# Altium schematic sheet TMRSensors.SchDoc
size A1; SheetNumber: 1; SheetTotal: 1
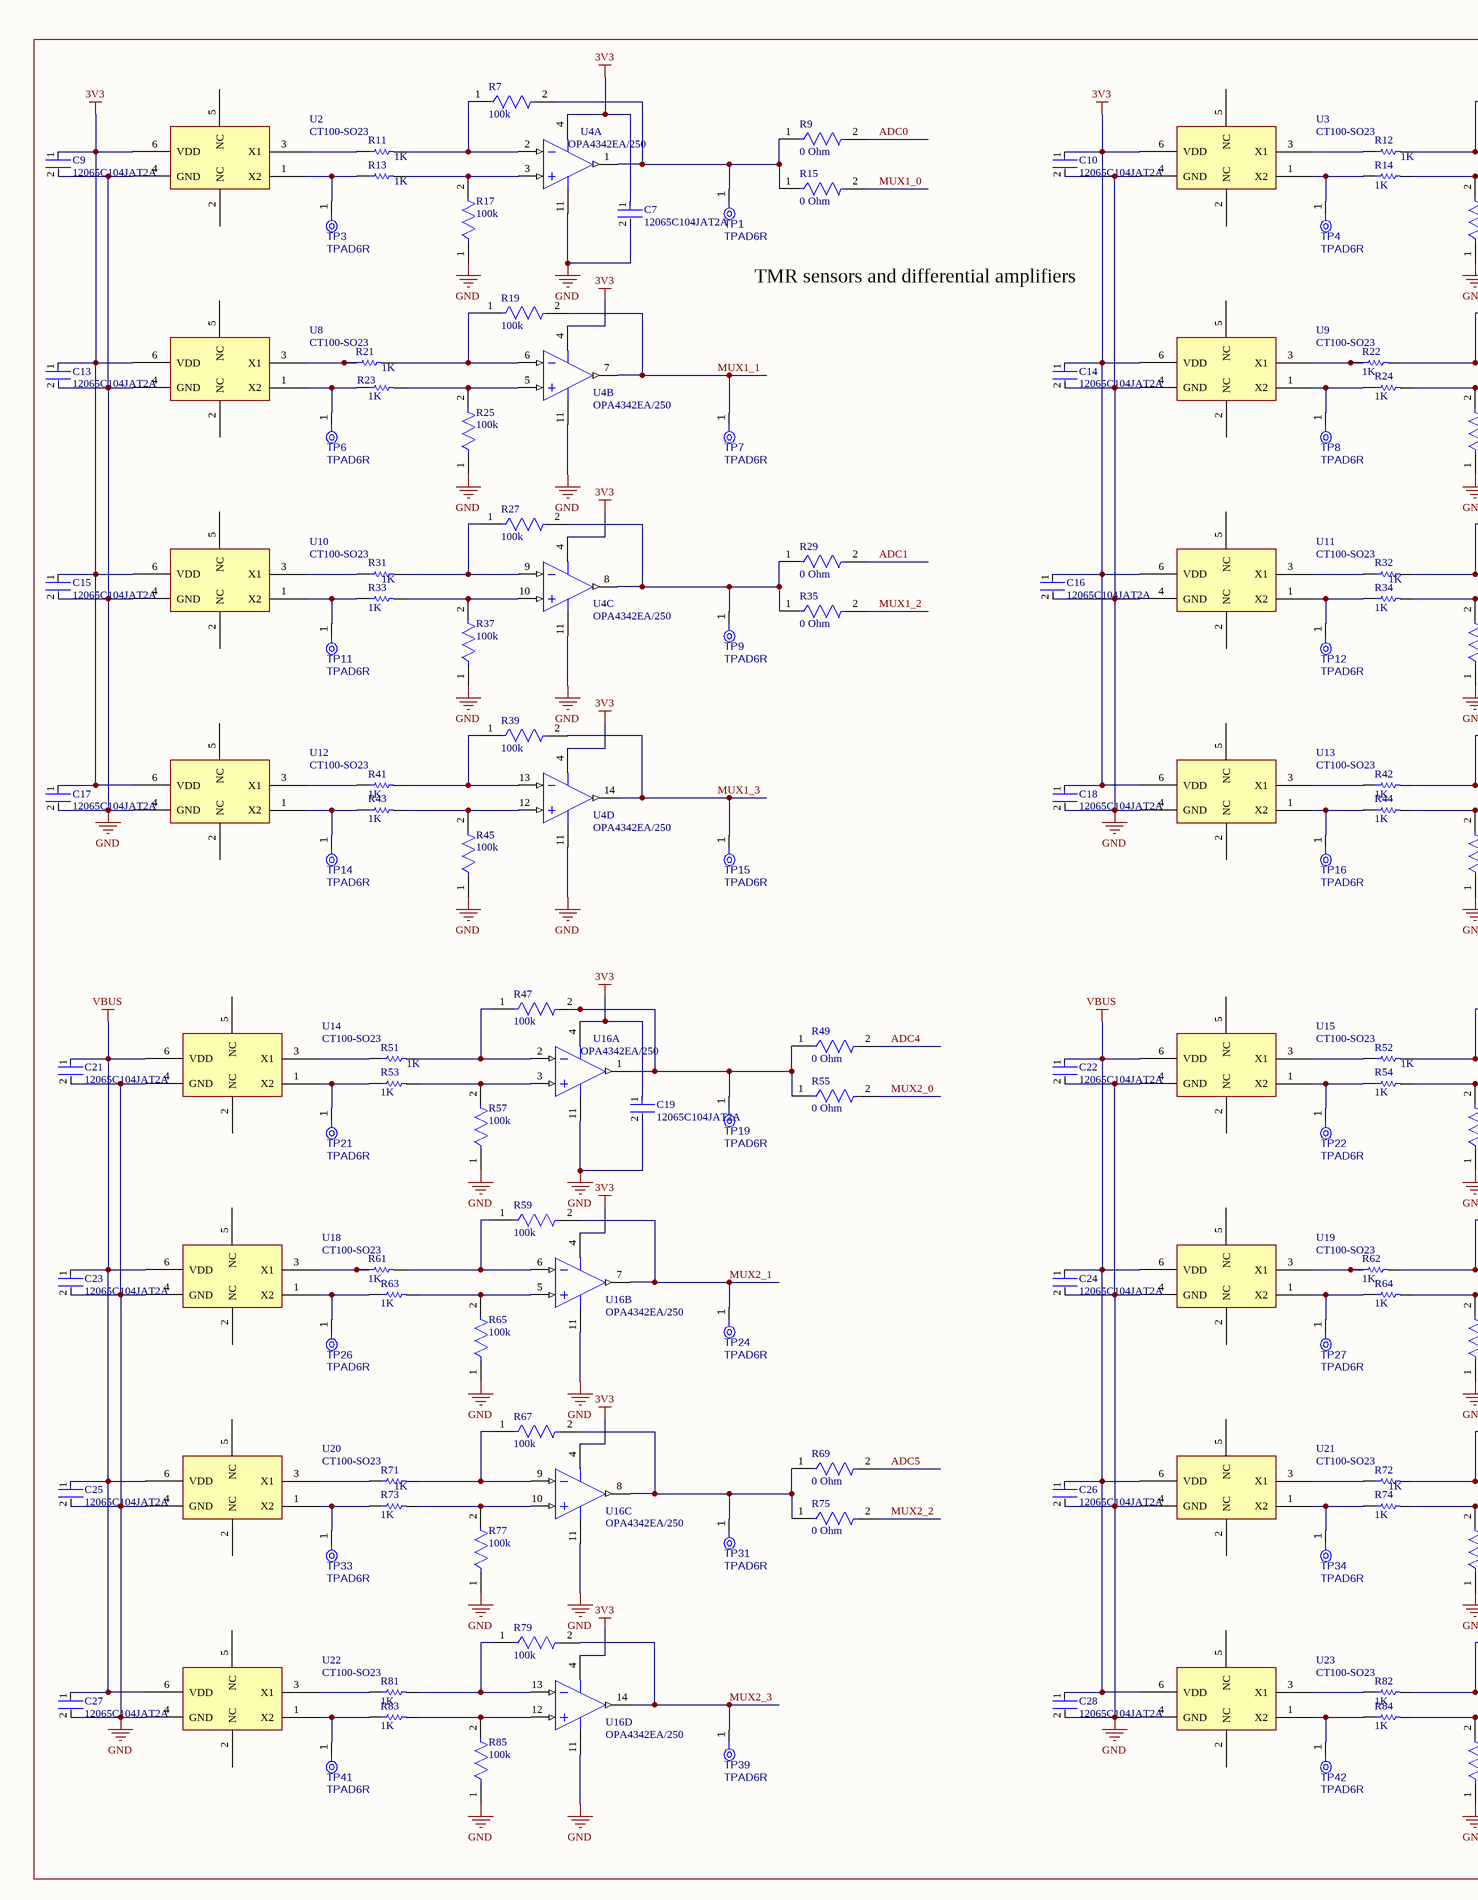
[diagram p0: TMRSensors.SchDoc, left]
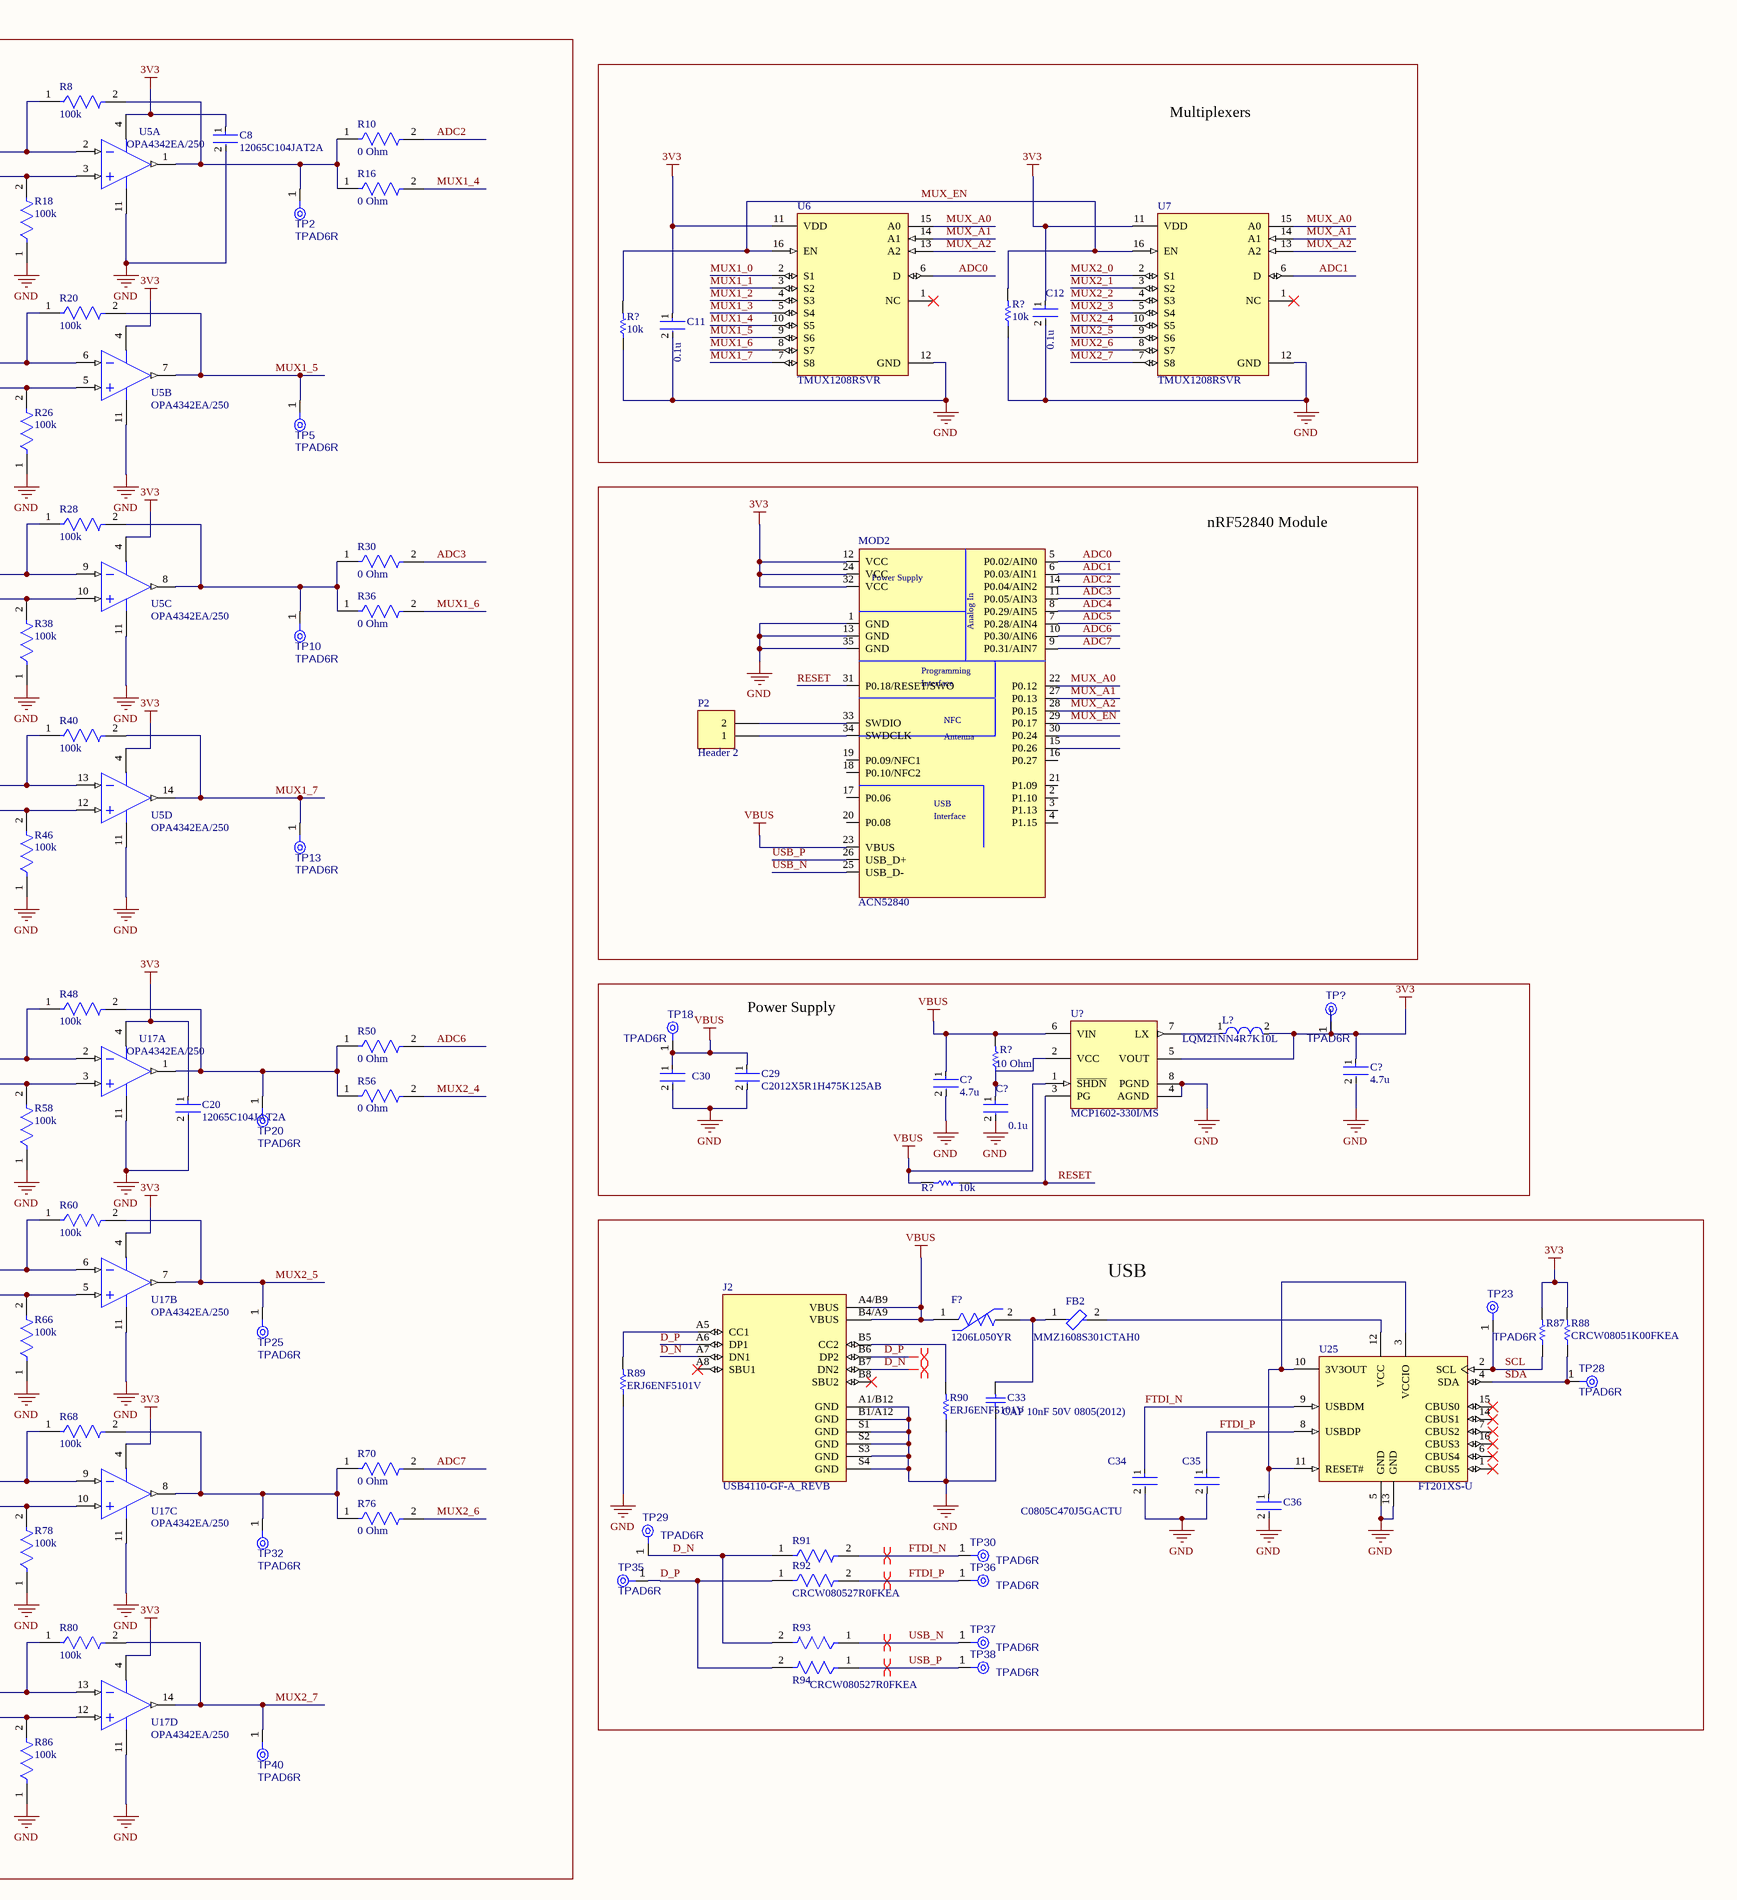
[diagram p1: TMRSensors.SchDoc, right]

## Parts
(Parts that share a designator on the sheet are numbered #1, #2 ... from top to bottom, then left to right.)
C7  12065C104JAT2A  [FP-1206-L_3_2_0_2-W_1_6_0-IPC_A]
C8  12065C104JAT2A  [FP-1206-L_3_2_0_2-W_1_6_0-IPC_A]
C9  12065C104JAT2A  [FP-1206-L_3_2_0_2-W_1_6_0-IPC_A]
C10  12065C104JAT2A  [FP-1206-L_3_2_0_2-W_1_6_0-IPC_A]
C11  0.1u  [FP-1206-L_3_2_0_2-W_1_6_0-IPC_A]
C12  0.1u  [FP-1206-L_3_2_0_2-W_1_6_0-IPC_A]
C13  12065C104JAT2A  [FP-1206-L_3_2_0_2-W_1_6_0-IPC_A]
C14  12065C104JAT2A  [FP-1206-L_3_2_0_2-W_1_6_0-IPC_A]
C15  12065C104JAT2A  [FP-1206-L_3_2_0_2-W_1_6_0-IPC_A]
C16  12065C104JAT2A  [FP-1206-L_3_2_0_2-W_1_6_0-IPC_A]
C17  12065C104JAT2A  [FP-1206-L_3_2_0_2-W_1_6_0-IPC_A]
C18  12065C104JAT2A  [FP-1206-L_3_2_0_2-W_1_6_0-IPC_A]
C19  12065C104JAT2A  [FP-1206-L_3_2_0_2-W_1_6_0-IPC_A]
C20  12065C104JAT2A  [FP-1206-L_3_2_0_2-W_1_6_0-IPC_A]
C21  12065C104JAT2A  [FP-1206-L_3_2_0_2-W_1_6_0-IPC_A]
C22  12065C104JAT2A  [FP-1206-L_3_2_0_2-W_1_6_0-IPC_A]
C23  12065C104JAT2A  [FP-1206-L_3_2_0_2-W_1_6_0-IPC_A]
C24  12065C104JAT2A  [FP-1206-L_3_2_0_2-W_1_6_0-IPC_A]
C25  12065C104JAT2A  [FP-1206-L_3_2_0_2-W_1_6_0-IPC_A]
C26  12065C104JAT2A  [FP-1206-L_3_2_0_2-W_1_6_0-IPC_A]
C27  12065C104JAT2A  [FP-1206-L_3_2_0_2-W_1_6_0-IPC_A]
C28  12065C104JAT2A  [FP-1206-L_3_2_0_2-W_1_6_0-IPC_A]
C29  C2012X5R1H475K125AB  [FP-C2012-125-0_2-IPC_B]
C30  C0805C104K5RACTU  [FP-C0805C-DN-MFG]  (value not drawn)
C33  CAP 10nF 50V 0805(2012)  [CAPC0805(2012)75_N]
C34  C0805C470J5GACTU  [FP-C0805C-DN-MFG]
C35  C0805C470J5GACTU  [FP-C0805C-DN-MFG]  (value not drawn)
C36  C0805C104K5RACTU  [FP-C0805C-DN-MFG]  (value not drawn)
C?#1  4.7u  [FP-C2012-125-0_2-IPC_B]
C?#2  4.7u  [FP-GRM32-MFG]
C?#3  0.1u  [FP-1206-L_3_2_0_2-W_1_6_0-IPC_A]
F?  1206L050YR  [FP-1206L050YR-MFG]
FB2  MMZ1608S301CTAH0  [FP-MMZ1608-0_6-IPC_C]
J2  USB4110-GF-A_REVB  [GCT_USB4110-GF-A_REVB]
L?  LQM21NN4R7K10L  [FP-LQM21DH_70-IPC_C]
MOD2  ACN52840  [ACN52840]
P2  Header 2  [HDR1X2]
R7  100k  [FP-AC0805-MFG]
R8  100k  [FP-AC0805-MFG]
R9  0 Ohm  [FP-RC1206-MFG]
R10  0 Ohm  [FP-RC1206-MFG]
R11  1K  [RESC3216X70X50LL05T20]
R12  1K  [RESC3216X70X50LL05T20]
R13  1K  [RESC3216X70X50LL05T20]
R14  1K  [RESC3216X70X50LL05T20]
R15  0 Ohm  [FP-RC1206-MFG]
R16  0 Ohm  [FP-RC1206-MFG]
R17  100k  [FP-AC0805-MFG]
R18  100k  [FP-AC0805-MFG]
R19  100k  [FP-AC0805-MFG]
R20  100k  [FP-AC0805-MFG]
R21  1K  [RESC3216X70X50LL05T20]
R22  1K  [RESC3216X70X50LL05T20]
R23  1K  [RESC3216X70X50LL05T20]
R24  1K  [RESC3216X70X50LL05T20]
R25  100k  [FP-AC0805-MFG]
R26  100k  [FP-AC0805-MFG]
R27  100k  [FP-AC0805-MFG]
R28  100k  [FP-AC0805-MFG]
R29  0 Ohm  [FP-RC1206-MFG]
R30  0 Ohm  [FP-RC1206-MFG]
R31  1K  [RESC3216X70X50LL05T20]
R32  1K  [RESC3216X70X50LL05T20]
R33  1K  [RESC3216X70X50LL05T20]
R34  1K  [RESC3216X70X50LL05T20]
R35  0 Ohm  [FP-RC1206-MFG]
R36  0 Ohm  [FP-RC1206-MFG]
R37  100k  [FP-AC0805-MFG]
R38  100k  [FP-AC0805-MFG]
R39  100k  [FP-AC0805-MFG]
R40  100k  [FP-AC0805-MFG]
R41  1K  [RESC3216X70X50LL05T20]
R42  1K  [RESC3216X70X50LL05T20]
R43  1K  [RESC3216X70X50LL05T20]
R44  1K  [RESC3216X70X50LL05T20]
R45  100k  [FP-AC0805-MFG]
R46  100k  [FP-AC0805-MFG]
R47  100k  [FP-AC0805-MFG]
R48  100k  [FP-AC0805-MFG]
R49  0 Ohm  [FP-RC1206-MFG]
R50  0 Ohm  [FP-RC1206-MFG]
R51  1K  [RESC3216X70X50LL05T20]
R52  1K  [RESC3216X70X50LL05T20]
R53  1K  [RESC3216X70X50LL05T20]
R54  1K  [RESC3216X70X50LL05T20]
R55  0 Ohm  [FP-RC1206-MFG]
R56  0 Ohm  [FP-RC1206-MFG]
R57  100k  [FP-AC0805-MFG]
R58  100k  [FP-AC0805-MFG]
R59  100k  [FP-AC0805-MFG]
R60  100k  [FP-AC0805-MFG]
R61  1K  [RESC3216X70X50LL05T20]
R62  1K  [RESC3216X70X50LL05T20]
R63  1K  [RESC3216X70X50LL05T20]
R64  1K  [RESC3216X70X50LL05T20]
R65  100k  [FP-AC0805-MFG]
R66  100k  [FP-AC0805-MFG]
R67  100k  [FP-AC0805-MFG]
R68  100k  [FP-AC0805-MFG]
R69  0 Ohm  [FP-RC1206-MFG]
R70  0 Ohm  [FP-RC1206-MFG]
R71  1K  [RESC3216X70X50LL05T20]
R72  1K  [RESC3216X70X50LL05T20]
R73  1K  [RESC3216X70X50LL05T20]
R74  1K  [RESC3216X70X50LL05T20]
R75  0 Ohm  [FP-RC1206-MFG]
R76  0 Ohm  [FP-RC1206-MFG]
R77  100k  [FP-AC0805-MFG]
R78  100k  [FP-AC0805-MFG]
R79  100k  [FP-AC0805-MFG]
R80  100k  [FP-AC0805-MFG]
R81  1K  [RESC3216X70X50LL05T20]
R82  1K  [RESC3216X70X50LL05T20]
R83  1K  [RESC3216X70X50LL05T20]
R84  1K  [RESC3216X70X50LL05T20]
R85  100k  [FP-AC0805-MFG]
R86  100k  [FP-AC0805-MFG]
R87  CRCW08051K00FKEA  [RESC2013X50X30NL20T20]  (value not drawn)
R88  CRCW08051K00FKEA  [RESC2013X50X30NL20T20]
R89  ERJ6ENF5101V  [RESC2013X70X40LL20T20]
R90  ERJ6ENF5101V  [RESC2013X70X40LL20T20]
R91  CRCW080527R0FKEA  [FP-CRCW0805-e3-IPC_B]  (value not drawn)
R92  CRCW080527R0FKEA  [FP-CRCW0805-e3-IPC_B]
R93  CRCW080527R0FKEA  [FP-CRCW0805-e3-IPC_B]
R94  CRCW080527R0FKEA  [FP-CRCW0805-e3-IPC_B]  (value not drawn)
R?#1  10k  [RESC2013X60X35NL10T20]
R?#2  10k  [RESC2013X60X35NL10T20]
R?#3  10 Ohm  [RESC2013X60X35ML10T20]
R?#4  10k  [RESC2013X60X35NL10T20]
TP1  TPAD6R  [TP06R]  (no BOM)
TP2  TPAD6R  [TP06R]  (no BOM)
TP3  TPAD6R  [TP06R]  (no BOM)
TP4  TPAD6R  [TP06R]  (no BOM)
TP5  TPAD6R  [TP06R]  (no BOM)
TP6  TPAD6R  [TP06R]  (no BOM)
TP7  TPAD6R  [TP06R]  (no BOM)
TP8  TPAD6R  [TP06R]  (no BOM)
TP9  TPAD6R  [TP06R]  (no BOM)
TP10  TPAD6R  [TP06R]  (no BOM)
TP11  TPAD6R  [TP06R]  (no BOM)
TP12  TPAD6R  [TP06R]  (no BOM)
TP13  TPAD6R  [TP06R]  (no BOM)
TP14  TPAD6R  [TP06R]  (no BOM)
TP15  TPAD6R  [TP06R]  (no BOM)
TP16  TPAD6R  [TP06R]  (no BOM)
TP18  TPAD6R  [TP06R]  (no BOM)
TP19  TPAD6R  [TP06R]  (no BOM)
TP20  TPAD6R  [TP06R]  (no BOM)
TP21  TPAD6R  [TP06R]  (no BOM)
TP22  TPAD6R  [TP06R]  (no BOM)
TP23  TPAD6R  [TP06R]  (no BOM)
TP24  TPAD6R  [TP06R]  (no BOM)
TP25  TPAD6R  [TP06R]  (no BOM)
TP26  TPAD6R  [TP06R]  (no BOM)
TP27  TPAD6R  [TP06R]  (no BOM)
TP28  TPAD6R  [TP06R]  (no BOM)
TP29  TPAD6R  [TP06R]  (no BOM)
TP30  TPAD6R  [TP06R]  (no BOM)
TP31  TPAD6R  [TP06R]  (no BOM)
TP32  TPAD6R  [TP06R]  (no BOM)
TP33  TPAD6R  [TP06R]  (no BOM)
TP34  TPAD6R  [TP06R]  (no BOM)
TP35  TPAD6R  [TP06R]  (no BOM)
TP36  TPAD6R  [TP06R]  (no BOM)
TP37  TPAD6R  [TP06R]  (no BOM)
TP38  TPAD6R  [TP06R]  (no BOM)
TP39  TPAD6R  [TP06R]  (no BOM)
TP40  TPAD6R  [TP06R]  (no BOM)
TP41  TPAD6R  [TP06R]  (no BOM)
TP42  TPAD6R  [TP06R]  (no BOM)
TP?  TPAD6R  [TP06R]  (no BOM)
U2  CT100-SO23  [SOT95P280X135-6N]
U3  CT100-SO23  [SOT95P280X135-6N]
U4  OPA4342EA/250  [PW0014A_M]  (parts A,B,C,D of 4)
U5  OPA4342EA/250  [PW0014A_M]  (parts A,B,C,D of 4)
U6  TMUX1208RSVR  [FP-RSV0016A-MFG]
U7  TMUX1208RSVR  [FP-RSV0016A-MFG]
U8  CT100-SO23  [SOT95P280X135-6N]
U9  CT100-SO23  [SOT95P280X135-6N]
U10  CT100-SO23  [SOT95P280X135-6N]
U11  CT100-SO23  [SOT95P280X135-6N]
U12  CT100-SO23  [SOT95P280X135-6N]
U13  CT100-SO23  [SOT95P280X135-6N]
U14  CT100-SO23  [SOT95P280X135-6N]
U15  CT100-SO23  [SOT95P280X135-6N]
U16  OPA4342EA/250  [PW0014A_M]  (parts A,B,C,D of 4)
U17  OPA4342EA/250  [PW0014A_M]  (parts A,B,C,D of 4)
U18  CT100-SO23  [SOT95P280X135-6N]
U19  CT100-SO23  [SOT95P280X135-6N]
U20  CT100-SO23  [SOT95P280X135-6N]
U21  CT100-SO23  [SOT95P280X135-6N]
U22  CT100-SO23  [SOT95P280X135-6N]
U23  CT100-SO23  [SOT95P280X135-6N]
U25  FT201XS-U  [SSOP-16_N]
U?  MCP1602-330I/MS  [MSOP-MS8_M]

## Nets
3V3: C7.1 C8.1 C9.1 C10.1 C11.1 C12.1 C13.1 C14.1 C15.1 C16.1 C17.1 C18.1 C19.1 C20.1 C?#1.1 L?.2 MOD2.12(VCC) MOD2.24(VCC) MOD2.32(VCC) R87.2 R88.2 TP?.1(TP) U2.6(VDD) U3.6(VDD) U4.4(V+) U5.4(V+) U6.11(VDD) U7.11(VDD) U8.6(VDD) U9.6(VDD) U10.6(VDD) U11.6(VDD) U12.6(VDD) U13.6(VDD) U16.4(V+) U17.4(V+) U?.5(VOUT)
GND: C7.2 C8.2 C9.2 C10.2 C11.2 C12.2 C13.2 C14.2 C15.2 C16.2 C17.2 C18.2 C19.2 C20.2 C21.2 C22.2 C23.2 C24.2 C25.2 C26.2 C27.2 C28.2 C29.2 C30.2 C33.1 C34.2 C35.2 C36.2 C?#1.2 C?#2.2 C?#3.2 J2.A1/B12(GND) J2.B1/A12(GND) J2.S1(GND) J2.S2(GND) J2.S3(GND) J2.S4(GND) MOD2.1(GND) MOD2.13(GND) MOD2.35(GND) R17.1 R18.1 R25.1 R26.1 R37.1 R38.1 R45.1 R46.1 R57.1 R58.1 R65.1 R66.1 R77.1 R78.1 R85.1 R86.1 R89.1 R90.1 R?#1.1 R?#2.1 U2.4(GND) U3.4(GND) U4.11(V-) U5.11(V-) U6.12(GND) U7.12(GND) U8.4(GND) U9.4(GND) U10.4(GND) U11.4(GND) U12.4(GND) U13.4(GND) U14.4(GND) U15.4(GND) U16.11(V-) U17.11(V-) U18.4(GND) U19.4(GND) U20.4(GND) U21.4(GND) U22.4(GND) U23.4(GND) U25.5(GND) U25.13(GND) U?.4(AGND) U?.8(PGND)
VBUS: C21.1 C22.1 C23.1 C24.1 C25.1 C26.1 C27.1 C28.1 C29.1 C30.1 C?#2.1 F?.1 J2.A4/B9(VBUS) J2.B4/A9(VBUS) MOD2.23(VBUS) R?#3.2 R?#4.2 TP18.1(TP) U14.6(VDD) U15.6(VDD) U18.6(VDD) U19.6(VDD) U20.6(VDD) U21.6(VDD) U22.6(VDD) U23.6(VDD) U?.1(~{SHDN}) U?.6(VIN)
ADC0: MOD2.5(P0.02/AIN0) R9.2 U6.6(D)
ADC1: MOD2.6(P0.03/AIN1) R29.2 U7.6(D)
ADC2: MOD2.14(P0.04/AIN2) R10.2
ADC3: MOD2.11(P0.05/AIN3) R30.2
ADC4: MOD2.8(P0.29/AIN5) R49.2
ADC5: MOD2.7(P0.28/AIN4) R69.2
ADC6: MOD2.10(P0.30/AIN6) R50.2
ADC7: MOD2.9(P0.31/AIN7) R70.2
D_N: J2.A7(DN1) J2.B7(DN2) R91.1 R93.2 TP29.1(TP)
D_P: J2.A6(DP1) J2.B6(DP2) R92.1 R94.2 TP35.1(TP)
FTDI_N: C34.1 R91.2 TP30.1(TP) U25.9(USBDM)
FTDI_P: C35.1 R92.2 TP36.1(TP) U25.8(USBDP)
MUX1_0: R15.2 U6.2(S1)
MUX1_1: R19.2 TP7.1(TP) U4.7(OUT_B) U6.3(S2)
MUX1_2: R35.2 U6.4(S3)
MUX1_3: R39.2 TP15.1(TP) U4.14(OUT_D) U6.5(S4)
MUX1_4: R16.2 U6.10(S5)
MUX1_5: R20.2 TP5.1(TP) U5.7(OUT_B) U6.9(S6)
MUX1_6: R36.2 U6.8(S7)
MUX1_7: R40.2 TP13.1(TP) U5.14(OUT_D) U6.7(S8)
MUX2_0: R55.2 U7.2(S1)
MUX2_1: R59.2 TP24.1(TP) U7.3(S2) U16.7(OUT_B)
MUX2_2: R75.2 U7.4(S3)
MUX2_3: R79.2 TP39.1(TP) U7.5(S4) U16.14(OUT_D)
MUX2_4: R56.2 U7.10(S5)
MUX2_5: R60.2 TP25.1(TP) U7.9(S6) U17.7(OUT_B)
MUX2_6: R76.2 U7.8(S7)
MUX2_7: R80.2 TP40.1(TP) U7.7(S8) U17.14(OUT_D)
MUX_A0: MOD2.22(P0.12) U6.15(A0) U7.15(A0)
MUX_A1: MOD2.27(P0.13) U6.14(A1) U7.14(A1)
MUX_A2: MOD2.28(P0.15) U6.13(A2) U7.13(A2)
MUX_EN: MOD2.29(P0.17) R?#1.2 R?#2.2 U6.16(EN) U7.16(EN)
RESET: MOD2.31(P0.18/RESET/SWO) R?#4.1 U?.3(PG)
SCL: R87.1 TP23.1(TP) U25.2(SCL)
SDA: R88.1 TP28.1(TP) U25.4(SDA)
USB_N: MOD2.25(USB_D-) R93.1 TP37.1(TP)
USB_P: MOD2.26(USB_D+) R94.1 TP38.1(TP)
NetC33_2: C33.2 F?.2 FB2.1
NetC36_1: C36.1 U25.3(VCCIO) U25.10(3V3OUT) U25.11(RESET#)
NetC?#3_1: C?#3.1 R?#3.1 U?.2(VCC)
NetFB2_2: FB2.2 U25.12(VCC)
NetJ2_A5: J2.A5(CC1) R89.2
NetJ2_B5: J2.B5(CC2) R90.2
NetL?_1: L?.1 U?.7(LX)
NetMOD2_33: MOD2.33(SWDIO) P2.2
NetMOD2_34: MOD2.34(SWDCLK) P2.1
NetR7_1: R7.1 R11.2 U4.2(IN_A-)
NetR7_2: R7.2 R9.1 R15.1 TP1.1(TP) U4.1(OUT_A)
NetR8_1: R8.1 R12.2 U5.2(IN_A-)
NetR8_2: R8.2 R10.1 R16.1 TP2.1(TP) U5.1(OUT_A)
NetR11_1: R11.1 U2.3(X1)
NetR12_1: R12.1 U3.3(X1)
NetR13_1: R13.1 TP3.1(TP) U2.1(X2)
NetR13_2: R13.2 R17.2 U4.3(IN_A+)
NetR14_1: R14.1 TP4.1(TP) U3.1(X2)
NetR14_2: R14.2 R18.2 U5.3(IN_A+)
NetR19_1: R19.1 R21.2 U4.6(IN_B-)
NetR20_1: R20.1 R22.2 U5.6(IN_B-)
NetR21_1: R21.1 U8.3(X1)
NetR22_1: R22.1 U9.3(X1)
NetR23_1: R23.1 TP6.1(TP) U8.1(X2)
NetR23_2: R23.2 R25.2 U4.5(IN_B+)
NetR24_1: R24.1 TP8.1(TP) U9.1(X2)
NetR24_2: R24.2 R26.2 U5.5(IN_B+)
NetR27_1: R27.1 R31.2 U4.9(IN_C-)
NetR27_2: R27.2 R29.1 R35.1 TP9.1(TP) U4.8(OUT_C)
NetR28_1: R28.1 R32.2 U5.9(IN_C-)
NetR28_2: R28.2 R30.1 R36.1 TP10.1(TP) U5.8(OUT_C)
NetR31_1: R31.1 U10.3(X1)
NetR32_1: R32.1 U11.3(X1)
NetR33_1: R33.1 TP11.1(TP) U10.1(X2)
NetR33_2: R33.2 R37.2 U4.10(IN_C+)
NetR34_1: R34.1 TP12.1(TP) U11.1(X2)
NetR34_2: R34.2 R38.2 U5.10(IN_C+)
NetR39_1: R39.1 R41.2 U4.13(IN_D-)
NetR40_1: R40.1 R42.2 U5.13(IN_D-)
NetR41_1: R41.1 U12.3(X1)
NetR42_1: R42.1 U13.3(X1)
NetR43_1: R43.1 TP14.1(TP) U12.1(X2)
NetR43_2: R43.2 R45.2 U4.12(IN_D+)
NetR44_1: R44.1 TP16.1(TP) U13.1(X2)
NetR44_2: R44.2 R46.2 U5.12(IN_D+)
NetR47_1: R47.1 R51.2 U16.2(IN_A-)
NetR47_2: R47.2 R49.1 R55.1 TP19.1(TP) U16.1(OUT_A)
NetR48_1: R48.1 R52.2 U17.2(IN_A-)
NetR48_2: R48.2 R50.1 R56.1 TP20.1(TP) U17.1(OUT_A)
NetR51_1: R51.1 U14.3(X1)
NetR52_1: R52.1 U15.3(X1)
NetR53_1: R53.1 TP21.1(TP) U14.1(X2)
NetR53_2: R53.2 R57.2 U16.3(IN_A+)
NetR54_1: R54.1 TP22.1(TP) U15.1(X2)
NetR54_2: R54.2 R58.2 U17.3(IN_A+)
NetR59_1: R59.1 R61.2 U16.6(IN_B-)
NetR60_1: R60.1 R62.2 U17.6(IN_B-)
NetR61_1: R61.1 U18.3(X1)
NetR62_1: R62.1 U19.3(X1)
NetR63_1: R63.1 TP26.1(TP) U18.1(X2)
NetR63_2: R63.2 R65.2 U16.5(IN_B+)
NetR64_1: R64.1 TP27.1(TP) U19.1(X2)
NetR64_2: R64.2 R66.2 U17.5(IN_B+)
NetR67_1: R67.1 R71.2 U16.9(IN_C-)
NetR67_2: R67.2 R69.1 R75.1 TP31.1(TP) U16.8(OUT_C)
NetR68_1: R68.1 R72.2 U17.9(IN_C-)
NetR68_2: R68.2 R70.1 R76.1 TP32.1(TP) U17.8(OUT_C)
NetR71_1: R71.1 U20.3(X1)
NetR72_1: R72.1 U21.3(X1)
NetR73_1: R73.1 TP33.1(TP) U20.1(X2)
NetR73_2: R73.2 R77.2 U16.10(IN_C+)
NetR74_1: R74.1 TP34.1(TP) U21.1(X2)
NetR74_2: R74.2 R78.2 U17.10(IN_C+)
NetR79_1: R79.1 R81.2 U16.13(IN_D-)
NetR80_1: R80.1 R82.2 U17.13(IN_D-)
NetR81_1: R81.1 U22.3(X1)
NetR82_1: R82.1 U23.3(X1)
NetR83_1: R83.1 TP41.1(TP) U22.1(X2)
NetR83_2: R83.2 R85.2 U16.12(IN_D+)
NetR84_1: R84.1 TP42.1(TP) U23.1(X2)
NetR84_2: R84.2 R86.2 U17.12(IN_D+)

Not connected (* = marked no-connect by the designer): J2 A8(SBU1)* B8(SBU2)*; MOD2 2(P1.10) 3(P1.13) 4(P1.15) 15(P0.26) 16(P0.27) 17(P0.06) 18(P0.10/NFC2) 19(P0.09/NFC1) 20(P0.08) 21(P1.09) 30(P0.24); U2 2(NC) 5(NC); U3 2(NC) 5(NC); U6 1(NC)*; U7 1(NC)*; U8 2(NC) 5(NC); U9 2(NC) 5(NC); U10 2(NC) 5(NC); U11 2(NC) 5(NC); U12 2(NC) 5(NC); U13 2(NC) 5(NC); U14 2(NC) 5(NC); U15 2(NC) 5(NC); U18 2(NC) 5(NC); U19 2(NC) 5(NC); U20 2(NC) 5(NC); U21 2(NC) 5(NC); U22 2(NC) 5(NC); U23 2(NC) 5(NC); U25 1(CBUS5)* 6(CBUS4)* 7(CBUS2)* 14(CBUS1)* 15(CBUS0)* 16(CBUS3)*

## Layout directives
differential pair: D_N, D_P, FTDI_N, FTDI_P, USB_N, USB_P

## Notes on the sheet
- Multiplexers
- TMR sensors and differential amplifiers
- nRF52840 Module
- Power Supply
- (near FB2) USB
- (in symbol ACN52840) Power Supply; Analog In; Programming; Interface; NFC; Antenna; USB

## Library data of the parts
C7-C28 C?#3 = CMP-04427-019132-1: General Purpose Ceramic Capacitor, 1206, 100nF, 5%, X7R, 15%, 50V; Insulation Resistance: 100GR; Dissipation Factor: 2.5%; Depth: 1.6mm; Case/Package: 1206; REACH SVHC: No SVHC; Capacitance: 100nF; Height: 0.5mm; Termination: SMD/SMT; Packaging: Cut Tape; Voltage: 50V; Min Operating Temperature: -55°C; Width: 1.6mm; Dielectric: X7R; Series: X7R; Case Code (Metric): 3216; Contact Plating: Tin; Package Quantity: 4000; Lead Free: Lead Free; Thickness: 0.037inch; Voltage Rating (DC): 50V; RoHS Compliant: Yes; Voltage Rating: 50V; Length: 3.2mm; Tolerance: 5%; Mount: Surface Mount; Radiation Hardening: No; Weight: 0.000571oz; Max Operating Temperature: 125°C; Dielectric Material: Ceramic; Case Code (Imperial): 1206
C29 C?#1 = CMP-08246-000007-2: Multilayer Ceramic Capacitors 4.7μF ±10% 50V X5R SMD 0805; Capacitance: 4.7uF; Case Code (Metric): 2012; Weight: 0.000194oz; Voltage Rating: 50V; Voltage: 50V; Construction: Flat; Series: C; Packaging: Tape and Reel; Height: 1.25mm; Depth: 1.25mm; Resistor Type: Ceramic; Width: 0.049inch; Length: 2mm; Thickness: 0.057inch; REACH SVHC: No SVHC; Max Operating Temperature: 85°C; Case/Package: 0805; Dielectric: X5R; Tolerance: 10%; Dielectric Material: Ceramic; Package Quantity: 1; Mount: Surface Mount; Radiation Hardening: No; Voltage Rating (DC): 50V; Case Code (Imperial): 0805; Termination: SMD/SMT; Min Operating Temperature: -55°C; Lead Free: Lead Free
C30 C36 = CMP-2007-00279-2: CAP CER 0.1UF 50V X7R 0805; Manufacturer: KEMET; Value: 0.10 μF; Tolerance: 0.1; Temperature Coefficient: 30ppm/°C; Material: Ceramic; Manufacturer Part Number: C0805C104K5RACTU; Device Class L2: Capacitors; Temperature Range Low: -55°C; Voltage Rating: 50 V; Digikey Description: CAP CER 0.1UF 50V X7R 0805; Category: Cap; ComponentLink2Description: Datasheet; Octopart: https://octopart.com/c0805c104k5ractu-kemet-143926; RoHS: TRUE; ComponentLink2URL: https://content.kemet.com/datasheets/KEM_C1003_C0G_SMD.pdf; Temperature Characteristic: X7R; Temperature: -55°C to +125°C; Height: 0.88mm; Temperature Range High: +125°C; Device Class L1: Passive Components; Automotive: No; Lead Free: Yes; Ipc Land Pattern Name: CAPC200125X78; Device Class L3: Ceramic Capacitors; Mouser Description: Cap Ceramic 0.1uF 50V X7R 10% SMD 2.0 x 1.2 mm 125 C Paper T/R; Capacitance: 0.10 μF; Package: C0805C-DN
C33 = CMP-1036-03839-1: CAP 10nF 50V ±5% 0805 (2012 Metric) Thickness 0.75mm SMD; Case-Metric: 2012; Case-EIA: 0805; Tolerance: Â±5%; Technology: SMT; Max Thickness: 0.75 mm; Rated Voltage: 50 V; Value: 10nF
C34 C35 = CMP-2007-00435-2: CAP CER 47PF 50V C0G/NP0 0805; Manufacturer: KEMET; Temperature Characteristic: C0G; Material: Ceramic; Temperature Coefficient: 30ppm/°C; Tolerance: 0.05; Temperature Range High: +125°C; Device Class L1: Passive Components; Device Class L3: Ceramic Capacitors; Lead Free: Yes; Manufacturer Part Number: C0805C470J5GACTU; Temperature: -55°C to +125°C; Capacitance: 47 pF; Height: 0.88mm; Octopart: https://octopart.com/c0805c470j5gactu-kemet-150274; RoHS: TRUE; Category: Cap; Voltage Rating: 50 V; Automotive: No; Device Class L2: Capacitors; Value: 47 pF; Ipc Land Pattern Name: CAPC200125X78; Temperature Range Low: -55°C; Mouser Description: Multilayer Ceramic Capacitors MLCC - SMD/SMT 50volts 47pF C0G 5%; Package: C0805C-DN; Digikey Description: CAP CER 47PF 50V C0G/NP0 0805; ComponentLink2URL: https://content.kemet.com/datasheets/KEM_C1003_C0G_SMD.pdf; ComponentLink2Description: Datasheet
C?#2 = CMP-1038-02162-3: CAP CER 4.7UF 50V X7R 1210; Manufacturer: Murata; Manufacturer Part Number: GRM32ER71H475KA88L; Tolerance: 10%; Temperature Coefficient: 15%; Material: Ceramic; Lead Free: Yes; Value: 4.7uF; ComponentLink2Description: Datasheet; Capacitance: 4.7uF; Digikey Description: CAP CER 4.7UF 50V X7R 1210; Category: Cap; Automotive: No; ComponentLink2URL: https://search.murata.co.jp/Ceramy/image/img/A01X/G101/ENG/GRM32ER71H475KA88-01A.pdf; Package: GRM32; Device Class L2: Capacitors; Voltage Rating: 50V; Device Class L1: Passive Components; Mouser Description: Capacitor Capacitance tolerance: ±10% Ceramic type: X7R Construction form: 1210 Capacitance: 4.7 µF Rated voltage: 50...; Octopart: https://octopart.com/grm32er71h475ka88l-murata-196576; Temperature: -55°C to +125°C; Temperature Range Low: -55°C; Height: 2.7mm; Temperature Characteristic: X7R; Temperature Range High: +125°C; RoHS: TRUE; Device Class L3: Ceramic Capacitors
F? = CMP-08606-000073-1: PTC RESET FUSE 6V 500MA 1206; Trip Current: 1A; Current Rating: 100A; Resistance: 700mR; Approvals: cULus; Max Power Dissipation: 600mW; Time to Trip: 0.1s; Hold Current: 500mA; Min Operating Temperature: -40°C; Voltage Rating (DC): 6V; Working Voltage: 6V; Package Quantity: 4000; Termination: SMD/SMT; Lead Free: Lead Free; REACH SVHC: No SVHC; Series: 1206L; Max Voltage Rating (DC): 6V; Height: 0.75mm; Terminal Material: Copper; Packaging: Tape and Reel; Case Code (Imperial): 1206; Length: 3.4mm; RoHS Compliant: Yes; Operating Supply Voltage: 6V; Case Code (Metric): 3216; Width: 1.8mm; Max Current Rating: 100A; Case/Package: 1206; Power Dissipation: 600mW; Max Operating Temperature: 85°C; Voltage Rating: 6V
FB2 = CMP-08257-000259-1: Signal Line Ferrite Bead 300 Ω 100MHz 500mA DCR 250mΩ SMD 0603; Tolerance: 25%; Impedance: 300R; Number of Lines: 1; DC Resistance (DCR): 250mR; Length: 0.063inch; Max DC Current: 500mA; Case Code (Imperial): 0603; Termination: SMD/SMT; Weight: 7.1E-05oz; RoHS Compliant: No; Mount: Surface Mount; Height: 0.037inch; Max Current Rating: 500mA; Max Operating Temperature: 125°C; Width: 0.031inch; Packaging: Tape and Reel; Test Frequency: 100MHz; Case Code (Metric): 1608; Case/Package: 0603; Min Operating Temperature: -55°C; Package Quantity: 4000
J2 = USB4110-GF-A_REVB: MF: {'manufacturer': u'GCT'}; MP: USB4110-GF-A_REVB; Package: None; Price: None; Availability: Unavailable; Value: *
L? = CMP-06042-016801-1: Multilayer Type Inductor for General Circuits, 0805 (2012), 22μH, 30%, 0.65Ω, 13mA; Shielding: Shielded; Inductance Tolerance: 10%; Core Material: Ferrite; DC Resistance (DCR): 1R; Test Frequency: 10MHz; Current Rating: 30mA; Inductance: 4.7uH; Self Resonant Frequency: 47MHz; Q Factor: 45; Packaging: Tape and Reel; Width: 1.25mm; Package Quantity: 1; REACH SVHC: No SVHC; Min Operating Temperature: -40°C; Tolerance: 10%; Lead Free: Lead Free; Depth: 1.45mm; Termination: SMD/SMT; Case Code (Imperial): 0805; Case Code (Metric): 2012; Rated Current-Max: 30mA; Military Standard: Not; Length: 2mm; Series: LQM21N; Case/Package: 0805; Max DC Current: 30mA; DC Current: 30mA; Mount: Surface Mount; Height: 0.85mm; Max Operating Temperature: 85°C; Radiation Hardening: No
MOD2 = ACN52840: aconno ACN52840 Bluetooth 5, 2.4 GHz Module nRF52840 based with on-board PCB antenna.  Note:  Due to the existence of a Tag-Connect interface on the backside of the module, a PCB cut-out has been implemented.; MF: {'manufacturer': u'aconno'}; Availability: Unavailable; MP: ACN52840; Price: None; Package: None; Value: *
P2 = Header 2: Header, 2-Pin; LatestRevisionDate: 17-Jul-2002; LatestRevisionNote: Re-released for DXP Platform.; Publisher: Altium Limited
R7 R8 R17-R20 R25-R28 R37-R40 R45-R48 R57-R60 R65-R68 R77-R80 R85 R86 = CMP-2001-04479-2: Res Thick Film 0805 100K Ohm 1% 1/8W ±100ppm/°C Molded SMD SMD Paper T/R; Manufacturer: Yageo; Manufacturer Part Number: AC0805FR-07100KL; Voltage Rating: 150V; Value: 100KΩ; Tolerance: 0.01; Automotive Grade: Grade 0; Composition: Thick Film; Octopart: https://octopart.com/ac0805fr-07100kl-yageo-24517275; Series: AC; Device Class L1: Passive Components; Height: 0.6mm; Package: AC0805; Digikey Description: Res Thick Film 0805 100K Ohm 1% 1/8W ±100ppm/°C Molded SMD SMD Paper T/R; Power Rating: 1/8W; Temperature: -55°C to +155°C; Temperature Range High: +155°C; RoHS: TRUE; Mouser Description: Thick Film Resistors 1/8W 100K ohm 1% AEC-Q200; Temperature Range Low: -55°C; Resistance: 100KΩ; Footprint Url: http://www.yageo.com/exep/pages/download/literatures/PYu-R_Mount_10.pdf; Ipc Land Pattern Name: RESC200125X50; ComponentLink2Description: Datasheet; Automotive: Yes; Category: Res; Device Class L3: Chip SMD Resistors; Lead Free: Yes; ComponentLink2URL: http://www.yageo.com/documents/recent/PYu-AC_51_RoHS_L_6.pdf; Device Class L2: Resistors
R9 R10 R15 R16 R29 R30 R35 R36 R49 R50 R55 R56 R69 R70 R75 R76 = CMP-2100-03681-2: RES SMD 0 OHM JUMPER 1/4W 1206; Manufacturer Part Number: RC1206JR-070RL; Manufacturer: YAGEO; Voltage Rating: 200V; Temperature Coefficient: 300ppm/°C; Power Rating: 0.25W; Value: 0Ω; Tolerance: 5%; Temperature Range Low: -55°C; Category: Res; Automotive: No; Ipc Land Pattern Name: RESC310160X55; Device Class L1: Passive Components; Temperature: -55°C to +155°C; ComponentLink2URL: https://www.yageo.com/upload/media/product/productsearch/datasheet/rchip/PYu-RC_Group_51_RoHS_L_10.pdf; Lead Free: Yes; Height: 0.65mm; Footprint Url: https://www.yageo.com/upload/website/yageo_PYu-R_Mount_10_19050818_343.pdf; Package: RC1206; Digikey Description: RES SMD 0 OHM JUMPER 1/4W 1206; Temperature Range High: +155°C; Device Class L3: Chip SMD Resistors; Device Class L2: Resistors; Octopart: https://octopart.com/rc1206jr-070rl-yageo-40025601; Resistance: 0Ω; Series: RC; ComponentLink2Description: Datasheet; Composition: Thick Film; RoHS: TRUE; Mouser Description: Resistor: thick film; SMD; 1206; 0O; 0.25W; ±5%; -55÷155°C
R11-R14 R21-R24 R31-R34 R41-R44 R51-R54 R61-R64 R71-R74 R81-R84 = CMP-2003-00017-1: Manufacturer: Panasonic; Part Number: ERJ-8ENF1001V
R87 R88 = CMP-1013-00510-2: Manufacturer: Vishay Dale; Part Number: CRCW08051K00FKEA
R89 R90 = CMP-2001-00553-1: Manufacturer: Panasonic; Part Number: ERJ6ENF5101V
R91-R94 = CMP-2001-03744-2: RES Thick Film, 27Ω, 1%, 0.125W, 100ppm/°C, 0805; Working Voltage: 150V; Resistance: 27R; Max Power Dissipation: 125mW; Composition: Thick Film; Termination: SMD/SMT; Temperature Coefficient: 100ppm/°C; Contact Plating: Tin; Width: 0.049inch; Features: Automotive AEC-Q200; Voltage Rating: 150V; Military Standard: Not; Case Code (Imperial): 0805; Case Code (Metric): 2012; Voltage Rating (DC): 150V; Radiation Hardening: No; Length: 2mm; Packaging: Tape and Reel; Weight: 0.000194oz; Tolerance: 1%; Number of Terminations: 2; Case/Package: 0805; Height: 0.45mm; Power Rating: 125mW; Max Operating Temperature: 155°C; Package Quantity: 10; Depth: 1.25mm; Number of Pins: 2; Min Operating Temperature: -55°C; Lead Free: Lead Free
R?#1 R?#2 R?#4 = CMP-1659-00013-4: Chip Resistor, 10 KOhm, +/- 1%, 0.125 W, -55 to 155 degC, 0805 (2012 Metric), RoHS, Tape and Reel; Manufacturer: Yageo; Voltage Rating: 150 V; Mount: Surface Mount; ComponentLink1Description: Manufacturer URL; ComponentLink2URL: http://www.yageo.com/documents/recent/PYu-RC_Group_51_RoHS_L_04.pdf; Pins: 2; Length: 2 mm; Min Operating Temperature: -55 degC; Height: 0.5 mm; Mounting Technology: Surface Mount; RoHSCompliant: true; REACH SVHC: No SVHC; ComponentLink1URL: http://www.yageo.com/; Max Operating Temperature: 155 degC; PackageReference: 0805; DatasheetVersion: Rev. 4, 02/2016; Package Quantity: 5000; Packaging: Tape and Reel; ComponentLink2Description: Datasheet; PackageDescription: 2-Pin Surface Mounted Device, Body 2 x 1.25 mm
R?#3 = CMP-2100-03670-1: Chip Resistor, 10 Ohm, +/- 1%, 0.125 W, -55 to 155 degC, 0805 (2012 Metric), RoHS, Tape and Reel; Manufacturer: Yageo; Resistance: 10Ohm; Power Rating: 125mW; Voltage Rating: 150V; Temperature Coefficient: 200ppm/degreesC; Number of Pins: 2; REACH SVHC: NoSVHC; Datasheet Version: Rev. 5, 10/2016; Max Operating Temperature: 155degC; Manufacturer URL: http://www.yageo.com/; Case Code (Imperial): 0805; Package Description: 2-Pin Surface Mounted Device, Body 2 x 1.25 mm; Case Code (Metric): 2012; Length: 2mm; RoHSCompliant: true; Max Power Dissipation: 125mW; Depth: 1.25mm; Packaging: TapeandReel; Height: 0.5mm; Package Reference: 0805; Package Quantity: 1; Tolerance: 1%; Termination: SMD/SMT; Min Operating Temperature: -55degC; Lead Free: LeadFree; Width: 1.25mm; Voltage Rating (DC): 150V; Datasheet URL: http://www.yageo.com/NewPortal/yageodocoutput?fileName=/pdf/R-Chip/PYu-RC_Group_51_RoHS_L_5.pdf; Composition: ThickFilm; Number of Terminations: 2; Case/Package: 0805
TP1-TP16 TP18-TP42 TP? = CMP-00028-00002-2: 0.6mm round; Pins: 1
U2 U3 U8-U15 U18-U23 = CMP-010-00025-1: TMR Sensor
U4 U5 U16 U17 = CMP-0272-01744-3: Low Cost, Low Power, Rail-to-Rail Operational Amplifier MicroAmplifier(TM) Series, 2.7 to 5.5 V, -55 to 125 degC, 14-pin SOP (PW14), Green (RoHS & no Sb/Br); Manufacturer: Texas Instruments; Rating: Catalog; IIB(Max)(pA): 10; Number of Channels: 4; Total Supply Voltage(Min)(+5V is 5, +/-5V is 10): 2.7; Slew Rate(Typ)(V/us): 1; Iq per channel(Max)(mA): 0.25; Sub Family: Low Input Bias Current Amp (<=10pA), Low Power Amp (<=500uA), Low Supply Voltage Amplifier (<=2.7V), Precision Amplifier; Offset Drift(Typ)(uV/C): 3; CMRR(Min)(dB): 76; Vio (25C)(Max)(mV): 6; Total Supply Voltage(Max)(+5V is 5, +/-5V is 10): 5.5; Packing: SMALL T&R; PackageReference: PW0014A; PackageVersion: 4040064-3/G, 02/2011; ComponentLink1Description: Manufacturer URL; Mounting Technology: Surface Mount; PackageDescription: 14-Pin Plastic Small Outline, Body 5 x 4.4 mm, Pitch 0.65 mm; ComponentLink2URL: http://www.ti.com/lit/ds/symlink/opa4342.pdf; ComponentLink3Description: Package Specification; Code_JEDEC: MO-153; ComponentLink3URL: http://www.ti.com/litv/pdf/mpds360; GBW(Typ)(MHz): 1; PartNumber: OPA4342EA/250; DatasheetVersion: SBOS106A; ComponentLink1URL: http://www.ti.com/; Eco-Plan: Green (RoHS & no Sb/Br); ComponentLink2Description: Datasheet
U6 U7 = CMP-04892-000061-1: IC SWITCH SINGLE 16UQFN; RoHS Compliant: Yes
U25 = CMP-0248-00016-2: USB to I2C Interface Slave Chip, UHCI/OHCI/EHCI Compatible, USB 2.0 Compatible, -40 to +85 degC, 16-Pin SSOP, Pb-Free, Tube; Manufacturer: FTDI; PartNumber: FT201XS-U; ComponentLink1URL: http://www.ftdichip.com/; ComponentLink3Description: FT201X Product Page; ComponentLink1Description: Manufacturer URL; ComponentLink2Description: Datasheet; DatasheetVersion: ver 1.3, Feb-2013; ComponentLink2URL: http://www.ftdichip.com/Support/Documents/DataSheets/ICs/DS_FT201X.pdf; ComponentLink3URL: www.ftdichip.com/Products/ICs/FT201X.html; RevisionNote: DatasheetVersion updated to 1.3 Feb-2013; PackageVersion: Feb-13; Code_JEDEC: MO-137-AB; PackageReference: SSOP-16; PackageDescription: 16-Pin Small Outline Package, 8.6 x 3.9 mm Body, 0.635 mm Pitch
U? = CMP-0139-00190-1: 500mA Synchronous Buck Regulator with PG, 3.3V, 2MHz, 8-Pin MSOP, Industrial Temperature; PackageDescription: 8-Lead Plastic Micro Small Outline Package (MS) [MSOP]; DatasheetVersion: revA, Oct-2007; PackageReference: MSOP-MS8; PackageVersion: revBB, Aug-2009